# EAGLE design sensor (EAGLE 7.5.0)

## Sheet 1 of 3
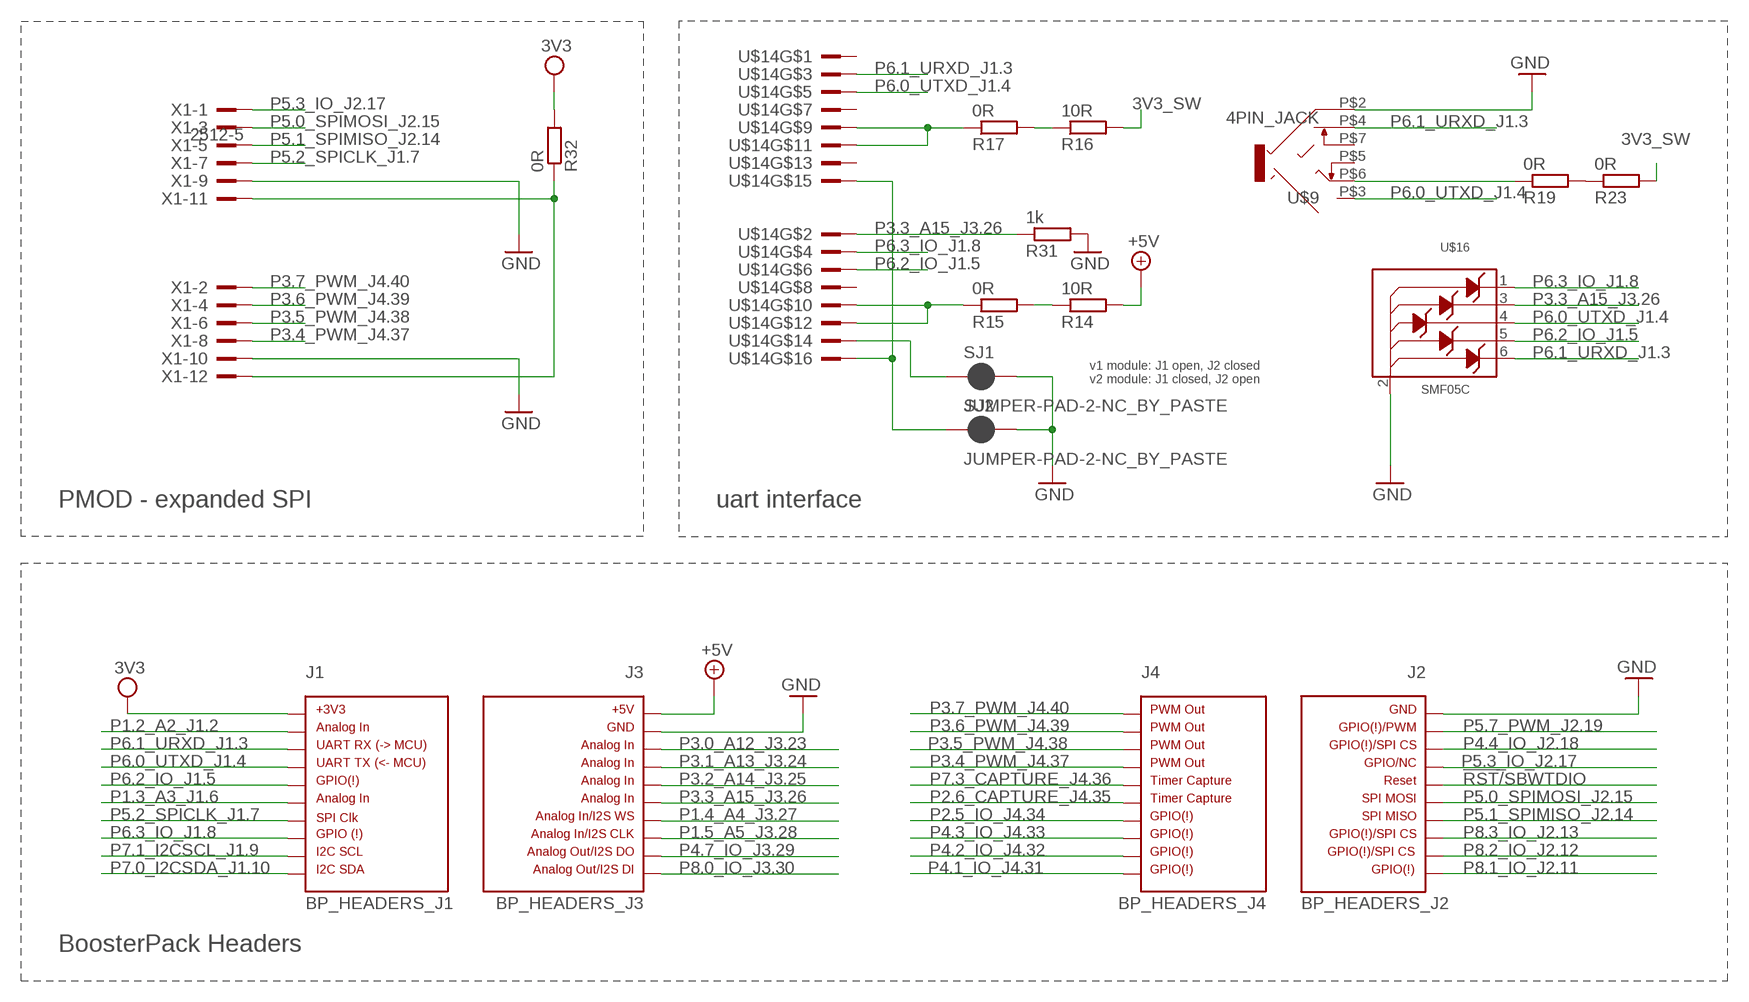
[diagram p0: schematic, sheet 1]

### Parts
J1  BP_HEADERS_J1  [J1]
J2  BP_HEADERS_J2  [J2]
J3  BP_HEADERS_J3  [J3]
J4  BP_HEADERS_J4  [J4]
R14  10R  R-EU_R0805W  [R0805W]
R15  0R  R-EU_0204/2V  [0204V]
R16  10R  R-EU_R0805W  [R0805W]
R17  0R  R-EU_0204/2V  [0204V]
R19  0R  R-EU_0204/2V  [0204V]
R23  0R  R-EU_R0805W  [R0805W]
R31  1k  R-EU_R0805W  [R0805W]
R32  0R  R-EU_0204/2V  [0204V]
SJ1  JUMPER-PAD-2-NC_BY_PASTE  [PAD-JUMPER-2-NC_BY_PASTE_YES_SILK]
SJ2  JUMPER-PAD-2-NC_BY_PASTE  [PAD-JUMPER-2-NC_BY_PASTE_YES_SILK]
U$9  4PIN_JACK  [4PIN_JACK]
U$14  2516-  [PAK100/2500-5-16]
U$16  SMF05C  [SC-88]
X1  2512-5  [PAK100/2500-5-12]

### Nets
3V3: J1.1 R32.2 ; also sheet 2,3
3V3_SW: R16.2 R23.2 ; also sheet 2
!RST!/SBWTDIO: J2.16
+5V: J3.21 R14.2 ; also sheet 2
GND: J2.20 J3.22 R31.2 SJ1.2 SJ2.2 U$9.P$2 U$16.2(ANODE) X1.9 X1.10 ; also sheet 2,3
N$4: R19.1 U$9.P$6
N$17: R16.1 R17.2
N$20: R17.1 U$14.9 U$14.11
N$21: R14.1 R15.2
N$22: R15.1 U$14.10 U$14.12
N$28: R19.2 R23.1
N$33: SJ1.1 U$14.14
N$34: SJ2.1 U$14.15 U$14.16
N$38: R32.1 X1.11 X1.12
P1.2_A2_J1.2: J1.2 ; also sheet 2
P1.3_A3_J1.6: J1.6 ; also sheet 3
P1.4_A4_J3.27: J3.27 ; also sheet 3
P1.5_A5_J3.28: J3.28 ; also sheet 3
P2.5_IO_J4.34: J4.34
P2.6_CAPTURE_J4.35: J4.35
P3.0_A12_J3.23: J3.23 ; also sheet 2
P3.1_A13_J3.24: J3.24 ; also sheet 2
P3.2_A14_J3.25: J3.25 ; also sheet 2
P3.3_A15_J3.26: J3.26 R31.1 U$14.2 U$16.3(CATODE2)
P3.4_PWM_J4.37: J4.37 X1.8
P3.5_PWM_J4.38: J4.38 X1.6
P3.6_PWM_J4.39: J4.39 X1.4
P3.7_PWM_J4.40: J4.40 X1.2
P4.1_IO_J4.31: J4.31
P4.2_IO_J4.32: J4.32
P4.3_IO_J4.33: J4.33
P4.4_IO_J2.18: J2.18
P4.7_IO_J3.29: J3.29 ; also sheet 2
P5.0_SPIMOSI_J2.15: J2.15 X1.3
P5.1_SPIMISO_J2.14: J2.14 X1.5
P5.2_SPICLK_J1.7: J1.7 X1.7
P5.3_IO_J2.17: J2.17 X1.1
P5.7_PWM_J2.19: J2.19
P6.0_UTXD_J1.4: J1.4 U$9.P$3 U$14.5 U$16.4(CATODE3)
P6.1_URXD_J1.3: J1.3 U$9.P$4 U$14.3 U$16.6(CATODE5)
P6.2_IO_J1.5: J1.5 U$14.6 U$16.5(CATODE4)
P6.3_IO_J1.8: J1.8 U$14.4 U$16.1(CATODE1)
P7.0_I2CSDA_J1.10: J1.10 ; also sheet 3
P7.1_I2CSCL_J1.9: J1.9 ; also sheet 3
P7.3_CAPTURE_J4.36: J4.36
P8.0_IO_J3.30: J3.30
P8.1_IO_J2.11: J2.11 ; also sheet 2
P8.2_IO_J2.12: J2.12
P8.3_IO_J2.13: J2.13
Unconnected: U$9.P$5 U$9.P$7 U$14.1 U$14.7 U$14.8 U$14.13

### Notes on the sheet
- v1 module: J1 open, J2 closed
  v2 module: J1 closed, J2 open
- PMOD - expanded SPI | uart interface
- BoosterPack Headers

## Sheet 2 of 3
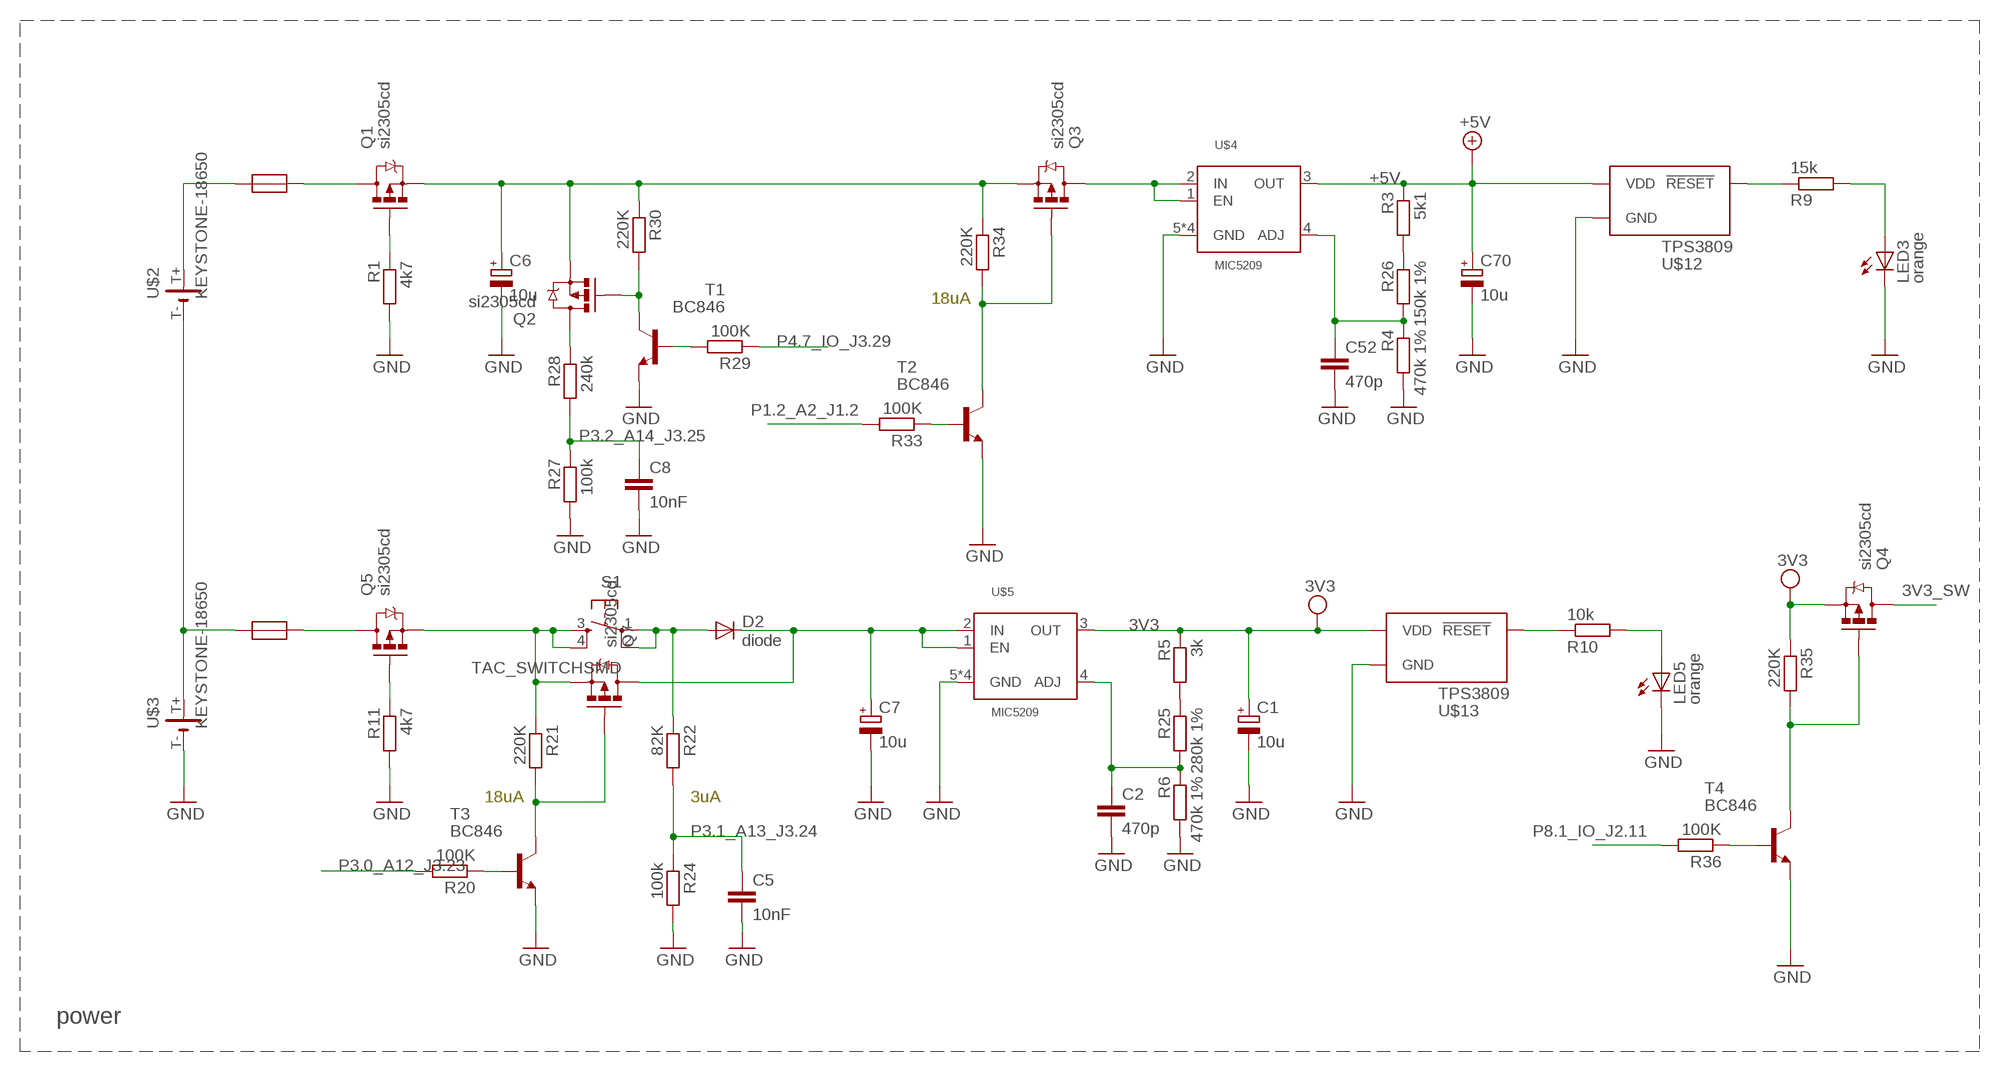
[diagram p1: schematic, sheet 2]

### Parts
C1  10u  CPOL-EU153CLV-0405  [153CLV-0405]
C2  470p  C-EUC0805  [C0805]
C5  10nF  C-EUC0805  [C0805]
C6  10u  CPOL-EU153CLV-0405  [153CLV-0405]
C7  10u  CPOL-EU153CLV-0405  [153CLV-0405]
C8  10nF  C-EUC0805  [C0805]
C52  470p  C-EUC0805  [C0805]
C70  10u  CPOL-EU153CLV-0405  [153CLV-0405]
D2  diode  DIODESMA  [SMA-DIODE]
LED3  orange  LEDCHIPLED_0805  [CHIPLED_0805]
LED5  orange  LEDCHIPLED_0805  [CHIPLED_0805]
Q1  si2305cd  MOSFET-PCHANNELSMD_POWER  [SOT23-3_POWER]
Q2  si2305cd  MOSFET-PCHANNELSMD_POWER  [SOT23-3_POWER]
Q3  si2305cd  MOSFET-PCHANNELSMD_POWER  [SOT23-3_POWER]
Q4  si2305cd  MOSFET-PCHANNELSMD_POWER  [SOT23-3_POWER]
Q5  si2305cd  MOSFET-PCHANNELSMD_POWER  [SOT23-3_POWER]
Q7  si2305cd  MOSFET-PCHANNELSMD_POWER  [SOT23-3_POWER]
R1  4k7  R-EU_R0805W  [R0805W]
R3  5k1  R-EU_R0805W  [R0805W]
R4  470k 1%  R-EU_R0805W  [R0805W]
R5  3k  R-EU_R0805W  [R0805W]
R6  470k 1%  R-EU_R0805W  [R0805W]
R9  15k  R-EU_R0805W  [R0805W]
R10  10k  R-EU_R0805W  [R0805W]
R11  4k7  R-EU_R0805W  [R0805W]
R20  100K  R-EU_R0805W  [R0805W]
R21  220K  R-EU_R0805W  [R0805W]
R22  82K  R-EU_R0805W  [R0805W]
R24  100k  R-EU_R0805W  [R0805W]
R25  280k 1%  R-EU_R0805W  [R0805W]
R26  150k 1%  R-EU_R0805W  [R0805W]
R27  100k  R-EU_R0805W  [R0805W]
R28  240k  R-EU_R0805W  [R0805W]
R29  100K  R-EU_R0805W  [R0805W]
R30  220K  R-EU_R0805W  [R0805W]
R33  100K  R-EU_R0805W  [R0805W]
R34  220K  R-EU_R0805W  [R0805W]
R35  220K  R-EU_R0805W  [R0805W]
R36  100K  R-EU_R0805W  [R0805W]
S1  TAC_SWITCHSMD  [TACTILE-SWITCH-SMD]
T1  BC846  [SOT23]
T2  BC846  [SOT23]
T3  BC846  [SOT23]
T4  BC846  [SOT23]
U$2  KEYSTONE-18650  [KEYSTONE_COMBO_18650]
U$3  KEYSTONE-18650  [KEYSTONE_COMBO_18650]
U$4  MIC5209  [SO-08]
U$5  MIC5209  [SO-08]
U$7  Fuse 1A  RESETTABLE_0805  [0805W]
U$8  Fuse 1A  RESETTABLE_0805  [0805W]
U$12  TPS3809  [R_PDSO_G3]
U$13  TPS3809  [R_PDSO_G3]

### Nets
3V3: C1.+ Q4.2(S) R5.1 R35.1 U$5.3(OUT) U$13.P$3(VDD) ; also sheet 1,3
3V3_SW: Q4.3(D) ; also sheet 1
+5V: C70.+ R3.1 U$4.3(OUT) U$12.P$3(VDD) ; also sheet 1
GND: C1.- C2.2 C5.2 C6.- C7.- C8.2 C52.2 C70.- LED3.C LED5.C R1.2 R4.2 R6.2 R11.2 R24.2 R27.2 T1.2(E) T2.2(E) T3.2(E) T4.2(E) U$3.T-(-) U$4.5(GND) U$4.6(GND) U$4.7(GND) U$4.8(GND) U$5.5(GND) U$5.6(GND) U$5.7(GND) U$5.8(GND) U$12.P$1(GND) U$13.P$1(GND) ; also sheet 1,3
N$1: C52.1 R4.1 R26.2 U$4.4(ADJ)
N$2: Q1.1(G) R1.1
N$3: C6.+ Q1.2(S) Q2.2(S) Q3.2(S) R30.1 R34.1
N$6: Q5.2(S) Q7.2(S) R21.1 S1.3 S1.4
N$7: LED3.A R9.2
N$9: C2.1 R6.1 R25.2 U$5.4(ADJ)
N$10: Q1.3(D) U$7.2
N$11: Q5.3(D) U$8.2
N$13: R9.1 U$12.P$2(!RESET)
N$14: LED5.A R10.2
N$15: R10.1 U$13.P$2(!RESET)
N$16: Q7.1(G) R21.2 T3.3(C)
N$23: C7.+ D2.C Q7.3(D) U$5.1(EN) U$5.2(IN)
N$24: Q5.1(G) R11.1
N$26: R5.2 R25.1
N$27: R3.2 R26.1
N$29: Q2.3(D) R28.1
N$30: Q2.1(G) R30.2 T1.3(C)
N$31: R20.1 T3.1(B)
N$32: R29.2 T1.1(B)
N$35: R33.1 T2.1(B)
N$36: Q3.3(D) U$4.1(EN) U$4.2(IN)
N$37: Q3.1(G) R34.2 T2.3(C)
N$39: R36.1 T4.1(B)
N$41: Q4.1(G) R35.2 T4.3(C)
N_BAT1: U$2.T-(-) U$3.T+(+) U$8.1
N_BAT2: U$2.T+(+) U$7.1
P1.2_A2_J1.2: R33.2 ; also sheet 1
P3.0_A12_J3.23: R20.2 ; also sheet 1
P3.1_A13_J3.24: C5.1 R22.2 R24.1 ; also sheet 1
P3.2_A14_J3.25: C8.1 R27.1 R28.2 ; also sheet 1
P4.7_IO_J3.29: R29.1 ; also sheet 1
P8.1_IO_J2.11: R36.2 ; also sheet 1
PUSH: D2.A R22.1 S1.1 S1.2

### Notes on the sheet
- 18uA
- 18uA | 3uA
- power

## Sheet 3 of 3
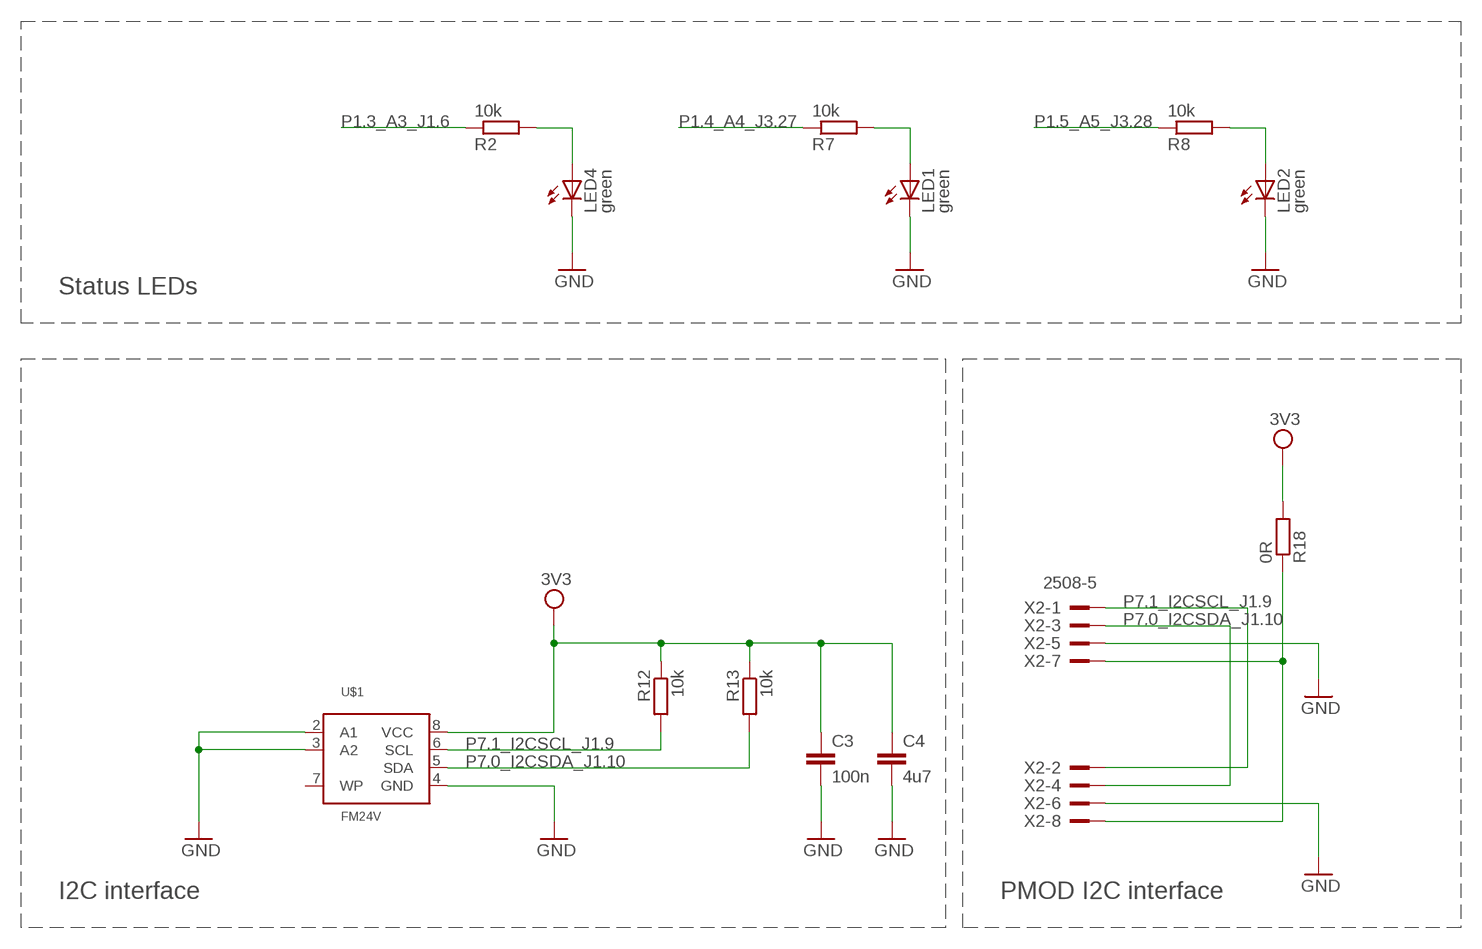
[diagram p2: schematic, sheet 3]

### Parts
C3  100n  C-EUC0805  [C0805]
C4  4u7  C-EUC0805  [C0805]
LED1  green  LEDCHIPLED_0805  [CHIPLED_0805]
LED2  green  LEDCHIPLED_0805  [CHIPLED_0805]
LED4  green  LEDCHIPLED_0805  [CHIPLED_0805]
R2  10k  R-EU_R0805W  [R0805W]
R7  10k  R-EU_R0805W  [R0805W]
R8  10k  R-EU_R0805W  [R0805W]
R12  10k  R-EU_R0805W  [R0805W]
R13  10k  R-EU_R0805W  [R0805W]
R18  0R  R-EU_0204/2V  [0204V]
U$1  FM24V  [SO-08]
X2  2508-5  [PAK100/2500-5-08]

### Nets
3V3: C3.1 C4.1 R12.1 R13.1 R18.2 U$1.8(VCC) ; also sheet 1,2
GND: C3.2 C4.2 LED1.C LED2.C LED4.C U$1.2(A1) U$1.3(A2) U$1.4(GND) X2.5 X2.6 ; also sheet 1,2
N$5: LED4.A R2.2
N$8: LED1.A R7.2
N$12: LED2.A R8.2
N$25: R18.1 X2.7 X2.8
P1.3_A3_J1.6: R2.1 ; also sheet 1
P1.4_A4_J3.27: R7.1 ; also sheet 1
P1.5_A5_J3.28: R8.1 ; also sheet 1
P7.0_I2CSDA_J1.10: R13.2 U$1.5(SDA) X2.3 X2.4 ; also sheet 1
P7.1_I2CSCL_J1.9: R12.2 U$1.6(SCL) X2.1 X2.2 ; also sheet 1
Unconnected: U$1.7(WP)

### Notes on the sheet
- Status LEDs
- I2C interface | PMOD I2C interface

## Library data of the parts
C1 C6 C7 C70 = rcl:CPOL-EU: POLARIZED CAPACITOR, European symbol
C2-C5 C8 C52 = rcl:C-EU: CAPACITOR, European symbol
D2 = SparkFun-DiscreteSemi:DIODE: Diode These are standard reverse protection diodes and small signal diodes. SMA package can handle up to about 1A. SOD-323 can handle about 200mA. What the SOD-323 package when ordering, there are some mfgs out there that are 5-pin packages.
J1 = LaunchPad_Template_Library:BP_HEADERS_J1
J2 = LaunchPad_Template_Library:BP_HEADERS_J2
J3 = LaunchPad_Template_Library:BP_HEADERS_J3
J4 = LaunchPad_Template_Library:BP_HEADERS_J4
LED1-LED5 = led:LED: LED OSRAM: - CHIPLED LG R971, LG N971, LY N971, LG Q971, LY Q971, LO R971, LY R971 LH N974, LH R974 LS Q976, LO Q976, LY Q976 LO Q996 - Hyper CHIPLED LW Q18S LB Q993, LB Q99A, LB R99A - SideLED LS A670, LO A670, LY A670, LG A670, LP A670 LB A673, LV A673, LT A673, LW A673 LH A674 LY A675 LS A676, LA A676, LO A676, LY A676, LW A676 LS A679, LY A679, LG A679 - Hyper Micro SIDELED® LS Y876, LA Y876, LO Y876, LY Y876 LT Y87S - SmartLED LW L88C, LW L88S LB L89C, LB L89S, LG L890 LS L89K, LO L89K, LY L89K LS L896, LA L896, LO L896, LY L896 - TOPLED LS T670, LO T670, LY T670, LG T670, LP T670 LSG T670, LSP T670, LSY T670, LOP T670, LYG T670 LG T671, LOG T671, LSG T671 LB T673, LV T673, LT T673, LW T673 LH T674 LS T676, LA T676, LO T676, LY T676, LB T676, LH T676, LSB T676, LW T676 LB T67C, LV T67C, LT T67C, LS T67K, LO T67K, LY T67K, LW E67C LS E67B, LA E67B, LO E67B, LY E67B, LB E67C, LV E67C, LT E67C LW T67C LS T679, LY T679, LG T679 LS T770, LO T770, LY T770, LG T770, LP T770 LB T773, LV T773, LT T773, LW T773 LH T774 LS E675, LA E675, LY E675, LS T675 LS T776, LA T776, LO T776, LY T776, LB T776 LHGB T686 LT T68C, LB T68C - Hyper Mini TOPLED® LB M676 - Mini TOPLED Santana® LG M470 LS M47K, LO M47K, LY M47K Source: http://www.osram.convergy.de LUXEON: - LUMILED® LXK2-PW12-R00, LXK2-PW12-S00, LXK2-PW14-U00, LXK2-PW14-V00 LXK2-PM12-R00, LXK2-PM12-S00, LXK2-PM14-U00 LXK2-PE12-Q00, LXK2-PE12-R00, LXK2-PE12-S00, LXK2-PE14-T00, LXK2-PE14-U00 LXK2-PB12-K00, LXK2-PB12-L00, LXK2-PB12-M00, LXK2-PB14-N00, LXK2-PB14-P00, LXK2-PB14-Q00 LXK2-PR12-L00, LXK2-PR12-M00, LXK2-PR14-Q00, LXK2-PR14-R00 LXK2-PD12-Q00, LXK2-PD12-R00, LXK2-PD12-S00 LXK2-PH12-R00, LXK2-PH12-S00 LXK2-PL12-P00, LXK2-PL12-Q00, LXK2-PL12-R00 Source: www.luxeon.com KINGBRIGHT: KA-3528ASYC Source: www.kingbright.com
Q1-Q5 Q7 = Simplex-DiscreteSemi:MOSFET-PCHANNEL: Generic PMOSFET
R1-R36 = rcl:R-EU_: RESISTOR, European symbol
S1 = SparkFun-Electromechanical:TAC_SWITCH: Momentary Switch Button commonly used for reset or general input. Spark Fun Electronics SKU : COM-00097 SMT- SWCH-08247; PROD_ID: SWCH-08247
SJ1 SJ2 = SparkFun-Passives:JUMPER-PAD-2-NC_BY_PASTE
T1-T4 = transistor:BC846: NPN TRANSISTOR
U$1 = Simplex-ICs:FM24V: CYPRESS FM24Vxx serial f-ram
U$2 U$3 = Simplex-Battery:KEYSTONE-18650
U$4 U$5 = Simplex-ICs:MIC5209: Micrel MIC5209
U$7 U$8 = Simplex-Fuses:RESETTABLE: resettable fuse
U$9 = Simplex-Connectors:4PIN_JACK
U$12 U$13 = Simplex-ICs:TPS3809: Texas Instruments TPS3809
U$14 = Simplex-Connectors:2516-
U$16 = Simplex-DiscreteSemi:SMF05C: ON Semiconductor SMF05C 5-line transient voltage suppressor array
X1 = Simplex-Connectors:2512-: 3M (TM) Pak 100 4-Wall Header Source: 3M; MPN: N2514-5002RB; OC_FARNELL: 1788673; OC_NEWARK: 97K6709
X2 = Simplex-Connectors:2508-: 3M (TM) Pak 100 4-Wall Header Source: 3M; OC_FARNELL: 1788669; OC_NEWARK: unknown

## Net classes
1 vcc: width 0.203 mm

## Board
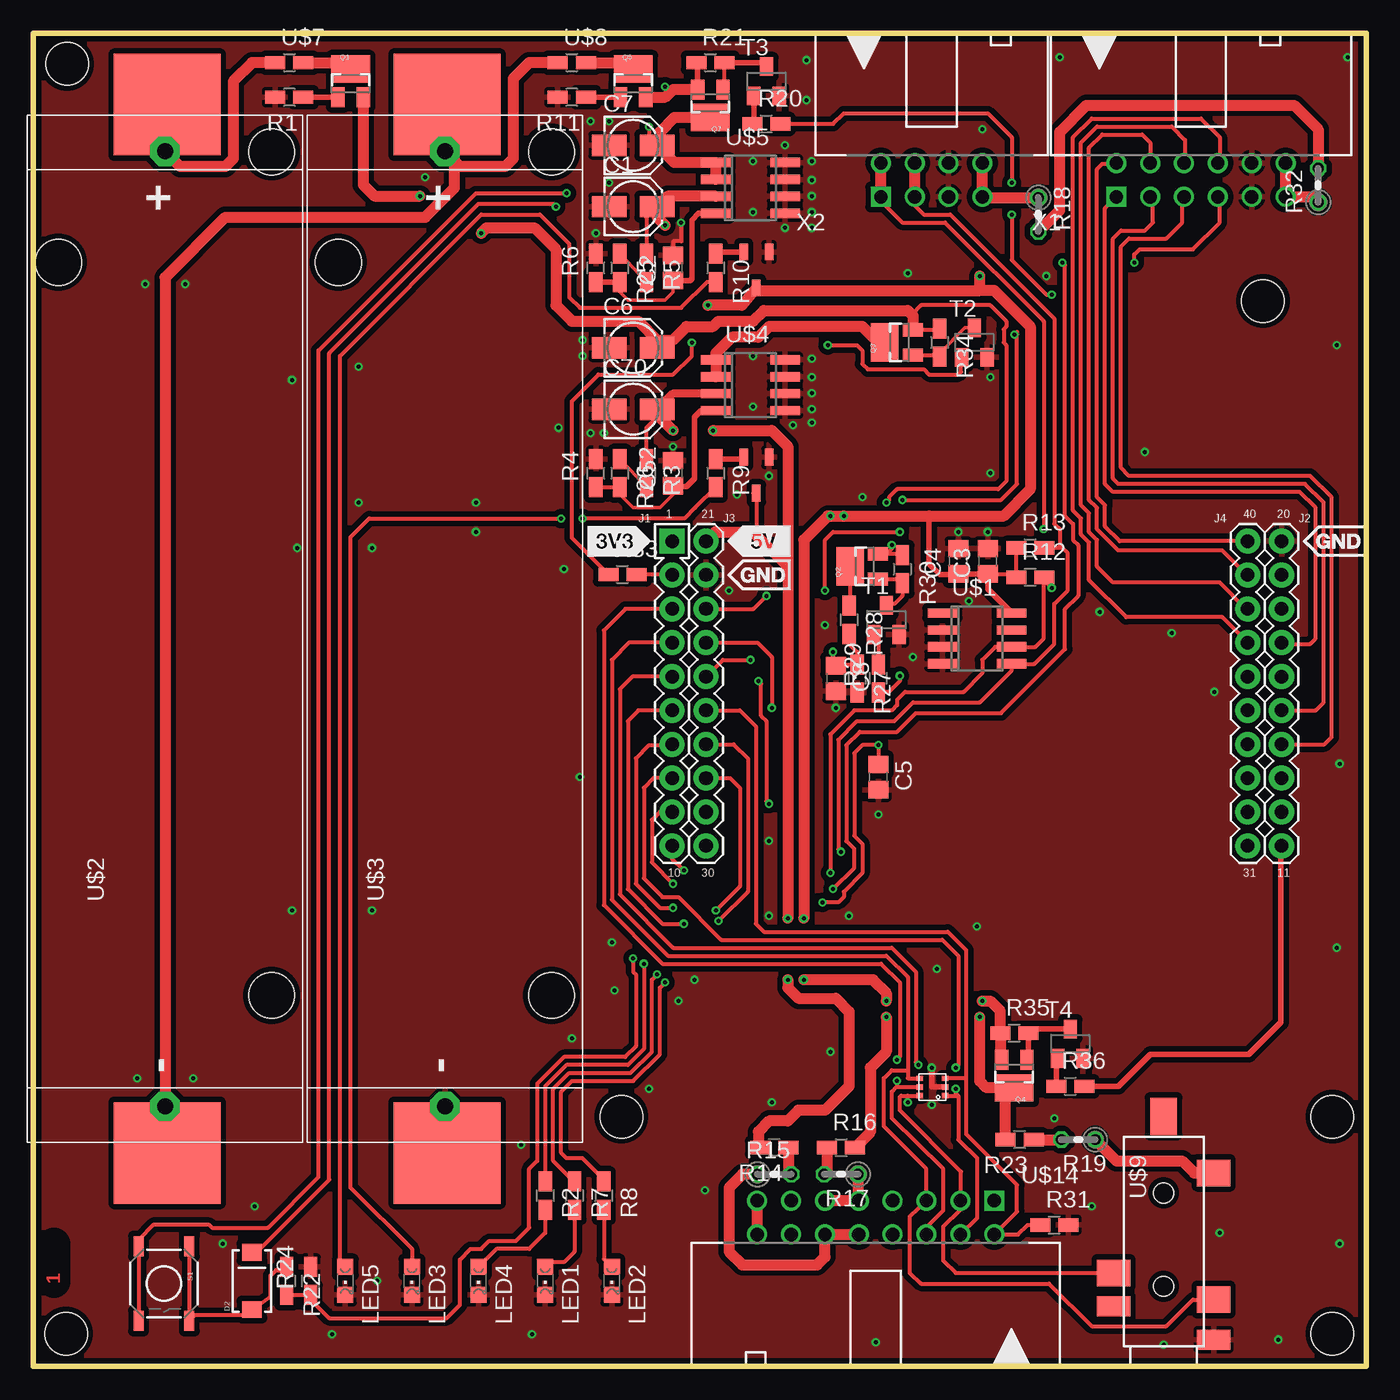
[diagram p3: board, top side]
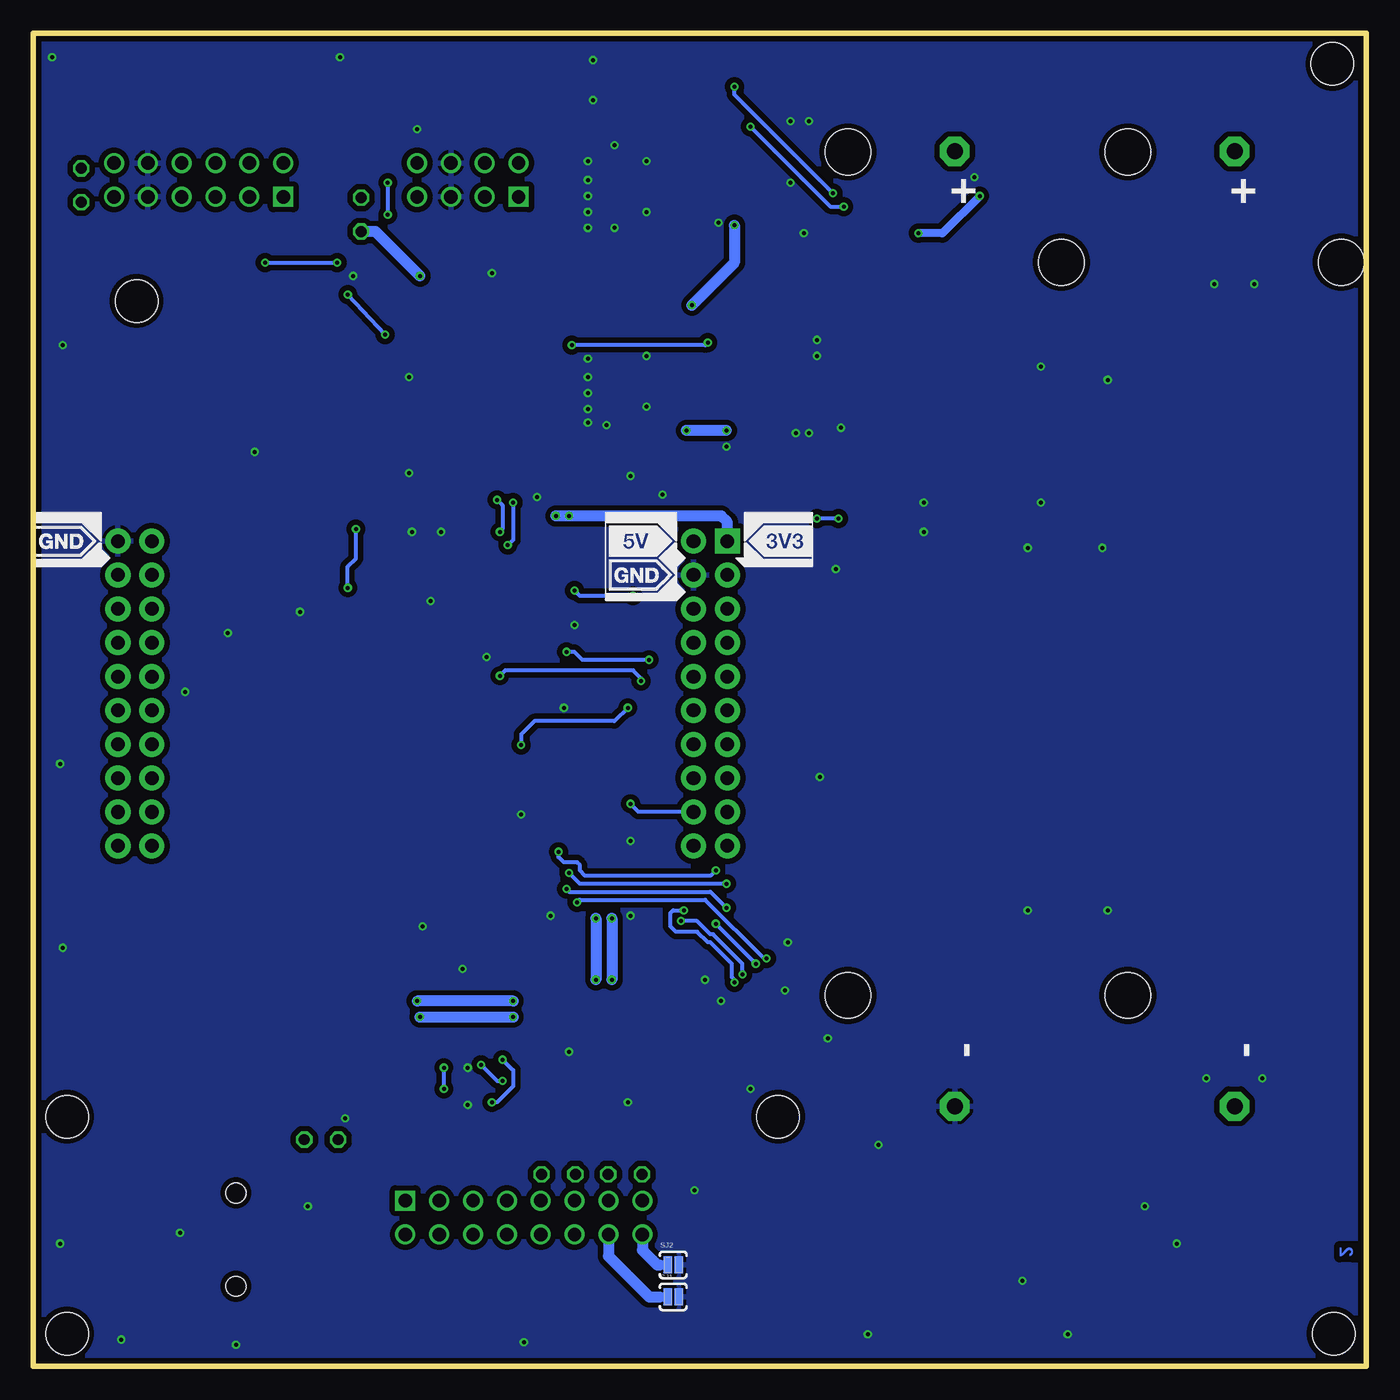
[diagram p4: board, bottom side, seen from below]

Size 100 x 100 mm. Coordinates in mm from the lower left corner, seen from the top.
Outline: 0,0 100,0 100,100 0,100 0,0
Copper layers (1*16): Top 0.035mm / dielectric 1.5mm / Bottom 0.035mm
Design rules "seeed_2-layer_20140221 *": minimum track width 6mil, minimum drill 0.3mm, track to track 10mil, track to pad 10mil, pad to pad 10mil, via to via 10mil, smd to smd 0mil, copper to edge 10mil, drill to drill 10mil, minimum pad ring 6mil, minimum via ring 6mil, stop-mask expansion 2mil, vias tented up to drill 100mil, thermal gap 10mil
Holes 3.2 mm at 2.45,2.45 44.12,18.72 97.46,18.72 2.54,97.71 97.46,2.45 92.26,79.92
tRestrict: 1 lines

### Footprints (pad centres in the part's own frame; a part is rotated, then mirrored left to right if it is on the bottom)
153CLV-0405 = smd 2.6 x 1.6: + 1.8,0; - -1.8,0
C0805 = smd 1.3 x 1.5: 1 -0.95,0; 2 0.95,0
SMA-DIODE = smd 1.27 x 1.47: A -2.15,0; C 2.15,0
J1 = drill 1.016 pad 1.88 square: 1 0,22.86 | drill 1.016 pad 1.88: 2 0,20.32; 3 0,17.78; 4 0,15.24; 5 0,12.7; 6 0,10.16; 7 0,7.62; 8 0,5.08; 9 0,2.54; 10 0,0
J2 = drill 1.016 pad 1.88: 11 0,0; 12 0,2.54; 13 0,5.08; 14 0,7.62; 15 0,10.16; 16 0,12.7; 17 0,15.24; 18 0,17.78; 19 0,20.32; 20 0,22.86
J3 = drill 1.016 pad 1.88: 21 0,22.86; 22 0,20.32; 23 0,17.78; 24 0,15.24; 25 0,12.7; 26 0,10.16; 27 0,7.62; 28 0,5.08; 29 0,2.54; 30 0,0
J4 = drill 1.016 pad 1.88: 31 0,0; 32 0,2.54; 33 0,5.08; 34 0,7.62; 35 0,10.16; 36 0,12.7; 37 0,15.24; 38 0,17.78; 39 0,20.32; 40 0,22.86
CHIPLED_0805 = smd 1.2 x 1.2: A 0,-1.05; C 0,1.05
SOT23-3_POWER = smd 1 x 1.5: 1 -0.939,-1.384; 2 0.961,-1.384 | smd 2.9 x 2.05: 3 0.011,0.716
R0805W = smd 1.5 x 1: 1 -1.052,0; 2 1.052,0
0204V = drill 0.813 octagon: 1 -1.27,0; 2 1.27,0
TACTILE-SWITCH-SMD = smd 1.524 x 0.762: 1 -2.794,1.905; 2 2.794,1.905; 3 -2.794,-1.905; 4 2.794,-1.905
PAD-JUMPER-2-NC_BY_PASTE_YES_SILK = smd 0.635 x 1.27: 1 -0.401,0; 2 0.413,0
SOT23 = smd 1 x 1.4: 1 -0.95,-1.1; 2 0.95,-1.1; 3 0,1.1
SO-08 = smd 0.7 x 2.2: 1 -1.905,-2.6; 2 -0.635,-2.6; 3 0.635,-2.6; 4 1.905,-2.6; 5 1.905,2.6; 6 0.635,2.6; 7 -0.635,2.6; 8 -1.905,2.6
KEYSTONE_COMBO_18650 = drill 1.2 pad 2.184 octagon: T+ 74.34,10.325; T- 2.7,10.325 | smd 7.6 x 8: T+$1 77.855,10.16; T-$1 -0.805,10.16 | hole 3.45: 11.025,2.32; 66.025,18.325; 74.305,2.32
0805W = smd 1.5 x 1: 1 -1.052,0; 2 1.052,0
4PIN_JACK = smd 1.5 x 2.5: P$2 2,-3.75; P$7 4.5,3.75 | smd 2 x 2.5: P$3 5,-3.75; P$4 7,3.75; P$6 14.5,-3.75 | smd 2.8 x 2: P$5 18.75,0 | hole 1.5: 6,0; 13,0
R_PDSO_G3 = smd 0.635 x 1.27: P$1 0,0; P$2 1.9,0; P$3 0.95,2.7
PAK100/2500-5-16 = drill 1 pad 1.422 square: 1 -8.89,-7.62 | drill 1 pad 1.422: 2 -8.89,-5.08; 3 -6.35,-7.62; 4 -6.35,-5.08; 5 -3.81,-7.62; 6 -3.81,-5.08; 7 -1.27,-7.62; 8 -1.27,-5.08; 9 1.27,-7.62; 10 1.27,-5.08; 11 3.81,-7.62; 12 3.81,-5.08; 13 6.35,-7.62; 14 6.35,-5.08; 15 8.89,-7.62; 16 8.89,-5.08
SC-88 = smd 0.5 x 0.4: 1 0,1.3; 2 0,0.65; 3 0,0; 4 1.9,0; 5 1.9,0.65; 6 1.9,1.3
PAK100/2500-5-12 = drill 1 pad 1.422 square: 1 -6.35,-1.27 | drill 1 pad 1.422: 2 -6.35,1.27; 3 -3.81,-1.27; 4 -3.81,1.27; 5 -1.27,-1.27; 6 -1.27,1.27; 7 1.27,-1.27; 8 1.27,1.27; 9 3.81,-1.27; 10 3.81,1.27; 11 6.35,-1.27; 12 6.35,1.27
PAK100/2500-5-08 = drill 1 pad 1.422 square: 1 -3.81,-1.27 | drill 1 pad 1.422: 2 -3.81,1.27; 3 -1.27,-1.27; 4 -1.27,1.27; 5 1.27,-1.27; 6 1.27,1.27; 7 3.81,-1.27; 8 3.81,1.27

### Placement (x,y rotation side)
C1  45,87 0 top
C2  48,82.4 90 top
C3  71.6,60.4 90 top
C4  69.4,60.4 90 top
C5  63.4,44.2 270 top
C6  45,76.4 0 top
C7  45,91.6 0 top
C8  60.2,51.6 270 top
C52  48,67 90 top
C70  45,71.8 0 top
D2  16.4,6.4 90 top
J1  47.93,39.04 0 top
J2  93.65,39.04 0 top
J3  50.47,39.04 0 top
J4  91.11,39.04 0 top
LED1  38.4,6.4 180 top
LED2  43.4,6.4 180 top
LED3  28.4,6.4 180 top
LED4  33.4,6.4 180 top
LED5  23.4,6.4 180 top
Q1  23.8,96.6 0 top
Q2  62,60 90 top
Q3  64.6,76.8 90 top
Q4  73.6,21.6 180 top
Q5  45,96.6 0 top
Q7  50.8,94.4 180 top
R1  19.2,95.2 180 top
R2  38.4,12.8 270 top
R3  46,67 270 top
R4  42.2,67 90 top
R5  46,82.4 270 top
R6  42.2,82.4 90 top
R7  40.6,12.8 270 top
R8  42.8,12.8 270 top
R9  51.2,67 270 top
R10  51.2,82.4 270 top
R11  40.4,95.2 180 top
R12  74.8,59.2 0 top
R13  74.8,61.4 0 top
R14  55.6,16.4 180 top
R15  55.6,14.4 0 top
R16  60.6,16.4 0 top
R17  60.6,14.4 180 top
R18  75.4,86.4 270 top
R19  78.4,17 180 top
R20  55,93.2 0 top
R21  50.8,97.8 0 top
R22  19,6.4 270 top
R23  74,17 180 top
R24  20.8,6.4 90 top
R25  44,82.4 270 top
R26  44,67 270 top
R27  61.8,51.6 270 top
R28  61.2,56 270 top
R29  63.4,51.6 90 top
R30  65.2,59.8 270 top
R31  76.6,10.6 0 top
R32  96.4,88.6 90 top
R33  44.2,59.4 0 top
R34  68,76.8 270 top
R35  73.6,25 0 top
R36  77.8,21 0 top
S1  9.8,6.2 270 top
SJ1  52,5.2 0 bottom
SJ2  52,7.6 0 bottom
T1  64,56 0 top
T2  70.6,76.8 0 top
T3  55,96.4 0 top
T4  77.8,24.2 0 top
U$1  70.8,54.6 270 top
U$2  20.2,16.8 90 top
U$3  41.2,16.8 90 top
U$4  53.8,73.6 270 top
U$5  53.8,88.4 270 top
U$7  19.2,97.8 0 top
U$8  40.4,97.8 0 top
U$9  84.8,0 90 top
U$12  55.2,68.2 180 top
U$13  55.2,83.6 180 top
U$14  63.2,4.8 180 top
U$16  68.4,21.6 180 top
X1  87.6,89 0 top
X2  67.4,89 0 top

### Tracks (layer width: path | path; a pad name or v marks a point on that pad's centre or on a via)
3V3  (via drill 0.3)
  Top 0.305: C3.1 73.5,59.45 R12.1 R13.1 | C1.+ 46,86.2 R5.1
  Top 0.406: 67.2,63.8 67.2,60.2 68,59.4 69.35,59.4 C4.1 C3.1 71.6,58.3 U$1.8
  Top 0.813: U$5.3 47.56,87.77 C1.+ 46.8,86.2 v47.4,85.6 | v50.6,79.6 53.15,79.6 U$13.P$3 54.45,80.7 71,80.7 | v57.8,33.6 57.8,62 59.6,63.8 v59.8,63.8 v60.8,63.8 67.2,63.8 72.8,63.8 74.8,65.8 74.8,78 72.1,80.7 71,80.7 | v57.8,29 63,29 64,28 v64,27.4 | 71,80.7 v71,81.8 | R18.2 77,86.73 77,92.6 79,94.6 94.6,94.6 96.4,92.8 R32.2 | Q4.2 72.55,23.07 R35.1 72.55,26.65 71.8,27.4 v71.2,27.4
  Bottom 0.813: J1.1 47.93,63.33 48.4,63.8 v60.8,63.8 | v47.4,85.6 47.4,82.8 v50.6,79.6 | v57.8,33.6 v57.8,29 | v71,81.8 74.33,85.13 R18.2 | v64,27.4 v71.2,27.4
3V3_SW  (via drill 0.3)
  Top 0.813: Q4.3 72.8,20.88 | 72.8,20.88 71.52,20.88 71,21.4 v71,26.2 | v64,26.2 64,23.6 62.8,22.4 62.8,17.55 R16.2 | R23.2 72.95,20.74 72.8,20.88
  Bottom 0.813: v71,26.2 v64,26.2
+5V  (via drill 0.3)
  Top 0.305: U$12.P$3 54.25,62.85 54,62.6 | R3.1 46,70.4 46.9,71.3
  Top 0.406: U$12.P$3 54.07,65.5
  Top 0.61: 46.8,71.4 C70.+ 47.97,72.97 U$4.3
  Top 0.813: J3.21 51.17,62.6 54,62.6 56.6,60 | 56.6,60 v56.6,33.6 | 46.8,71.4 46.9,71.3 v48,70.2 | v51,70.2 55.4,70.2 56.6,69 56.6,60 | v56.6,29 56.6,28.4 57.4,27.6 60.2,27.6 61.2,26.6 61.2,21 59.4,19.2 57.4,19.2 56.6,18.4 55.2,18.4 54.4,17.6 54.4,16.55 R14.2
  Bottom 0.813: v48,70.2 v51,70.2 | v56.6,33.6 v56.6,29
GND  (via drill 0.3)
  Top 0.305: v48.6,85.8 48.6,84.4 48,84.4 C2.2
  Top 0.406: U$16.2 67.4,20.95 v67.4,22.4
  other vias: 43.2,88.8 43.2,93.4 41.2,77 42.8,70 48,69 12,21.6 11.4,81.2 8.4,81.2 7.8,21.6 29.4,89.2 19.4,74 43.6,28.2 22.4,2.4 37.4,2.4 19.4,34.2 16.6,12 55.2,66.8 58.4,71.8 66,53.2 70.2,57.4 71.6,62.6 54,86.6 54,90.4 56.4,91.6 56.4,85.4 54,75.8 54,72 58.4,89 58.4,87.8 58.4,74.2 58.4,73 59.4,55.6 63.4,41.4 71.8,74.2 80,56.6 71.8,67 85.4,55 76,81.8 55.2,33.8 76.6,18.6 61.2,33.8 46.2,20.8 43.4,31.8 41,44.2 36.6,16.6 25.8,6.4 25.4,34.2 25.4,61.4 19.8,61.4 70.8,33 49.6,29 55.2,39.4 41.8,93.4 41.2,75.8 42.2,85 58.4,75.6 50.4,13.2 48.4,27.4 40.4,24.6 24.4,64.8 33.2,64.8 33.2,62.6 39.8,59.8 65.6,82 58.4,86.6 71.2,92.8 58,95 14.2,9.2 69.4,62.6 62.2,65.2 52.8,65.4 57,70.6 84.8,1.6 93.4,2 79.4,12 89,10 63.2,1.8 97.8,31.4 98,9.2 98.6,98.2 77,98.2 58,98 39.4,70.4 41.8,70 52.2,58.2 97.8,76.6 58.4,70.8 98,45.2 88.6,50.6 24.4,75 60.2,49.4 67.4,19.6 83.4,68.6 58.4,90.4 58.4,85.4 59.8,23.6 55.4,19.8 67.8,29.8
  pour Top (isolate 0.406): 0,100 100,100 100,0 0,0
  pour Bottom (isolate 0.406): 0,100 100,100 100,0 0,0
N$1
  Top 0.254: R26.2 44,65.4 45,64.4 47,64.4 48,65.4 C52.1
  Top 0.305: R4.1 R26.2 | U$4.4 50.09,71.69
  Top 0.406: C52.1 48.05,66 49,66 49.6,66.6 49.6,71.2 50.09,71.69
N$2
  Top 0.406: R1.1 22.86,95.2 Q1.1
N$3  (via drill 0.3)
  Top 0.305: v64,64.8 64.2,65 64.2,65.2 64.8,65.8 72.4,65.8 73,66.4 73,76.6 72.8,76.8 72.8,77.8 73,78 73,78.4 71.8,79.6 66.6,79.6 65.9,78.9 | Q2.2 64,60.96 | 64,60.96 65.09,60.96 R30.1 | v64.4,61.6 64.4,61.36 64,60.96 | Q3.2 67.69,77.76 R34.1
  Top 0.61: 65.9,78.9 66,78.8 | 66,77.78 Q3.2
  Top 0.813: C6.+ 46.8,77 | Q1.2 24.76,88.64 25.6,87.8 v29,87.8 | 46.8,77 45.4,78.4 40.4,78.4 39.2,79.6 39.2,83.8 37.6,85.4 34,85.4 v33.6,85 | 65.9,78.9 65.6,79.2 54.8,79.2 54,78.4 51.4,78.4 51,78 49,78 48,77 46.8,77 | 66,78.8 66,77.78
  Bottom 0.305: v64,64.8 64,62 v64.4,61.6
  Bottom 0.61: v29,87.8 31.8,85 v33.6,85
N$4
  Top 0.813: R19.1 81.27,15.4 86.2,15.4 87.1,14.5 U$9.P$6
N$5
  Top 0.305: R2.2 38.4,10 37.2,8.8 34.75,8.8 LED4.A
N$6  (via drill 0.3)
  Top 0.305: v40,88 33.2,88 21.4,76.2 21.4,14.2 17.6,10.4 13.4,10.4 13.2,10.6 9,10.6 7.89,9.49 S1.3 S1.4 | v47.4,96 47.8,95.6
  Top 0.406: Q7.2 49.84,97.71 R21.1
  Top 0.813: Q5.2 47.42,95.22 47.8,95.6 48,95.8 49.82,95.8 Q7.2
  Bottom 0.305: v40,88 47.4,95.4 v47.4,96
N$7  (via drill 0.3)
  Top 0.305: LED3.A 28.4,8.8 23.8,13.4 23.8,62.2 25.2,63.6 v39.6,63.6 | R9.2 49.65,64.4 48.85,63.6 v41.2,63.6
  Bottom 0.305: v39.6,63.6 v41.2,63.6
N$8
  Top 0.305: R7.2 40.6,8.6 39.8,7.8 38.75,7.8 LED1.A
N$9
  Top 0.254: R25.2 44,80.6 44.6,80 47.4,80 48,80.6 C2.1
  Top 0.406: 47.9,81.35 C2.1 49.25,81.45 49.4,81.6 49.4,86 49.9,86.5 U$5.4 | R6.1 R25.2
N$10
  Top 0.813: U$7.2 23.81,97.8 Q1.3
N$11
  Top 0.813: U$8.2 45.01,97.8 Q5.3
N$12
  Top 0.305: R8.2 42.8,8.05 LED2.A
N$13
  Top 0.406: R9.1 53.15,68.05 U$12.P$2
N$14
  Top 0.305: R10.2 50.55,81.35 48.6,79.4 41,79.4 40.2,80.2 40.2,84.2 38,86.4 33.6,86.4 23,75.8 23,7.85 LED5.A
N$15
  Top 0.406: R10.1 51.35,83.6 U$13.P$2
N$16
  Top 0.305: Q7.1 51.85,95.9 R21.2
  Top 0.406: 51.74,97.69 R21.2 54.7,97.8 T3.3
N$17
  Top 0.813: R16.1 59.55,14.62 R17.2
N$20
  Top 0.813: U$14.11 U$14.9 61.87,12.48 R17.1
N$21
  Top 0.813: R14.1 56.65,14.62 R15.2
N$22
  Top 0.813: U$14.10 U$14.12 59.4,8.2 58.8,7.6 53.2,7.6 52.2,8.6 52.2,13.4 53.2,14.4 R15.1
N$23  (via drill 0.3)
  Top 0.305: v39.2,87 39,87.2 33.4,87.2 22.2,76 22.2,14 16.4,8.2 D2.C | v46.2,93 46.2,91.6 C7.+
  Top 0.813: Q7.3 48.08,93.68 47,92.6 47,91.8 C7.+ 48.09,90.31 U$5.1 U$5.2
  Bottom 0.305: v46.2,93 40.2,87 v39.2,87
N$24
  Top 0.406: R11.1 44.06,95.2 Q5.1
N$25
  Top 0.813: X2.8 X2.7 71.27,87.67 R18.1
N$26
  Top 0.254: R5.2 R25.1
N$27
  Top 0.254: R26.1 R3.2
N$28
  Top 0.813: R23.1 R19.2
N$29
  Top 0.305: Q2.3 61.28,57.14 R28.1
N$30
  Top 0.305: Q2.1 64.89,59.06 R30.2 65.2,57.8 64.6,57.2 64.1,57.2 T1.3
N$31
  Top 0.406: T3.1 54.05,93.3 R20.1
N$32
  Top 0.305: T1.1 63.4,54.55 R29.2
N$33
  Bottom 0.61: 53,5.2 SJ1.1
  Bottom 0.813: U$14.14 56.85,8.25 53.8,5.2 53,5.2
N$34
  Top 0.813: U$14.15 U$14.16
  Bottom 0.61: 53,7.6 SJ2.1
  Bottom 0.813: U$14.16 54.31,8.71 53.2,7.6 53,7.6
N$35  (via drill 0.3)
  Top 0.305: R33.1 40.4,62.15 40.4,72.4 42.4,74.4 48,74.4 49.4,75.8 v49.4,76.8 | v59.6,76.6 61.8,76.6 62.2,76.2 62.2,75.2 62.6,74.8 66.8,74.8 67.2,74.4 69.4,74.4 69.6,74.6 69.6,75.65 T2.1
  Bottom 0.305: v49.4,76.8 49.6,76.6 v59.6,76.6
N$36
  Top 0.813: Q3.3 63.39,76.81 62.2,78 55.2,78 54.4,77.2 52.4,77.2 51.2,76 U$4.1 U$4.2
N$37
  Top 0.254: R34.2 68,76 69.9,77.9 T2.3
  Top 0.305: Q3.1 67.49,75.86 R34.2
N$38
  Top 0.813: X1.12 X1.11 96,87.73 R32.1
N$39
  Top 0.406: T4.1 76.75,23 R36.1
N$41
  Top 0.406: Q4.1 74.65,23.1 R35.2 74.95,25.3 T4.3
N_BAT1
  Top 0.813: U$2.T- 9.88,81.67 14.4,86.2 29.4,86.2 31.6,88.4 31.6,91.06 U$3.T+ 32.02,90 35.4,90 36,90.6 36,96.6 37.2,97.8 U$8.1
N_BAT2
  Top 0.813: U$7.1 16.4,97.8 15,96.4 15,90.6 14.4,90 11.02,90 U$2.T+
P1.2_A2_J1.2
  Top 0.305: J1.2 47.24,59.36 47.2,59.4 R33.2
P1.3_A3_J1.6  (via drill 0.3)
  Top 0.305: J1.6 45.4,49.2 44.6,48.4 44.6,35.8 47.2,33.2 v48.8,33.2 | v45.8,30.2 45.8,23.8 44.6,22.6 40,22.6 38.4,21 R2.1
  Bottom 0.305: v48.8,33.2 v45.8,30.2
P1.4_A4_J3.27  (via drill 0.3)
  Top 0.305: J3.27 52.54,46.66 53.6,45.6 53.6,35.6 v51.4,33.4 | R7.1 40.55,13.85 39,15.4 39,20.8 40.2,22 44.8,22 46.4,23.6 46.4,29 v46.8,29.4
  Bottom 0.305: v46.8,29.4 46.8,30.2 49,32.4 49.2,32.4 50.2,33.4 v51.4,33.4
P1.5_A5_J3.28  (via drill 0.3)
  Top 0.305: J3.28 52.28,44.12 53,43.4 53,36 v51.2,34.2 | R8.1 42.8,14 41.2,15.6 40,15.6 39.6,16 39.6,20.6 40.4,21.4 45,21.4 47,23.4 47,28.4 v47.4,28.8
  Bottom 0.305: v47.4,28.8 47.4,29 47.6,29.2 47.6,30.2 49.2,31.8 49.4,31.8 50.2,32.6 51.8,32.6 52.2,33 52.2,34 52,34.2 v51.2,34.2
P3.0_A12_J3.23  (via drill 0.3)
  Top 0.305: J3.23 54.02,56.82 v55,57.8 | v59.4,58.2 59.4,62 60,62.6 v65,62.6 | v65.2,65 72.6,65 73.8,66.2 73.8,77.4 | 73.8,77.4 73.8,77.6 | v73.6,77.4 73.8,77.4 | R20.2 60,93.2 60.8,94 71.6,94 73.4,92.2 v73.4,88.8 | v76.4,80.4 76,80.4 73.4,83 v73.4,86.4
  Bottom 0.305: v55,57.8 59,57.8 v59.4,58.2 | v76.4,80.4 v73.6,77.4 | v65.2,65 64.8,64.6 64.8,62.8 v65,62.6 | v73.4,88.8 v73.4,86.4
P3.1_A13_J3.24  (via drill 0.3)
  Top 0.305: R22.2 R24.1 20.8,5 22.2,3.6 31,3.6 32,4.6 32,8 32.8,8.8 33.6,8.8 34.2,9.4 36.2,9.4 37.2,10.4 37.2,14.8 37.8,15.4 37.8,21.2 39.8,23.2 44.4,23.2 45.2,24 45.2,29.4 45,29.6 v45,30.6 | J3.24 54.32,54.28 55.4,53.2 v55.4,49.4 | 63.45,45.2 C5.1 v63.4,46.6 62.2,46.6 61.6,46 61.6,39.8 62.2,39.2 62.2,37 60.8,35.6 60.8,35.2 60.4,34.8 v59.2,34.8
  Bottom 0.305: v55.4,49.4 56.4,48.4 62.4,48.4 63.4,47.4 v63.4,46.6 | v59.2,34.8 59,35 49.6,35 45.2,30.6 v45,30.6
P3.2_A14_J3.25  (via drill 0.3)
  Top 0.305: R28.2 61.2,54.2 61.8,53.6 R27.1 60,52.65 v60,53.6 60,52.75 C8.1 | J3.25 51.73,53 v53.8,53
  Bottom 0.305: v53.8,53 58.8,53 59.4,53.6 v60,53.6
P3.3_A15_J3.26
  Top 0.305: R31.1 74.6,10.6 73.88,9.88 U$14.2 73.8,11.59 73.8,13.6 70,17.4 70,21.6 | J3.26 53,49.2 54.2,48 54.2,33.2 54.8,32.6 68.6,32.6 70,31.2 70,21.6 | 70,21.6 U$16.3
P3.4_PWM_J4.37
  Top 0.305: J4.37 89.2,56.2 82,56.2 79.2,59 79.2,61.8 78.6,62.4 78.6,63.6 78,64.2 78,92.2 79.4,93.6 87.6,93.6 89,92.2 89,90.4 X1.8
P3.5_PWM_J4.38
  Top 0.305: J4.38 90.98,56.82 89,58.8 81,58.8 79.8,60 79.8,62 79.2,62.6 79.2,64 78.6,64.6 78.6,91.8 79.8,93 85.4,93 86.4,92 86.4,90.34 X1.6
P3.6_PWM_J4.39
  Top 0.305: J4.39 91.04,59.36 89.2,61.2 81.4,61.2 79.8,62.8 79.8,64.4 79.2,65 79.2,91.4 80.2,92.4 83.2,92.4 83.8,91.8 X1.4
P3.7_PWM_J4.40
  Top 0.305: J4.40 81.5,61.9 80.4,63 80.4,64.6 79.8,65.2 79.8,89.8 80.2,90.2 81.18,90.2 X1.2
P4.7_IO_J3.29  (via drill 0.3)
  Top 0.305: v54.4,51.4 54.6,51.2 54.6,48.8 55,48.4 55,42.4 v55.2,42.2 | v65,51.8 65,51.4 64.2,50.6 63.45,50.6 R29.1
  Bottom 0.305: v55.2,42.2 54.6,41.6 50.49,41.6 J3.29 | v54.4,51.4 54.4,51.6 55,52.2 64.6,52.2 v65,51.8
P5.0_SPIMOSI_J2.15
  Top 0.305: J2.15 96.2,49.2 96.8,49.8 96.8,64.8 95.4,66.2 81.4,66.2 81,66.6 81,84.6 81.6,85.2 83.4,85.2 84,85.8 84,87.52 X1.3
P5.1_SPIMISO_J2.14
  Top 0.305: J2.14 96.86,46.66 97.4,47.2 97.4,65.2 95.8,66.8 82.2,66.8 81.6,67.4 81.6,84 82.2,84.6 85,84.6 86.2,85.8 86.2,87.6 X1.5
P5.2_SPICLK_J1.7  (via drill 0.3)
  Top 0.305: v60,35.8 61.6,37.4 61.6,38.8 61,39.4 61,46.6 62,47.6 64.8,47.6 66.2,49 72.6,49 77.4,53.8 77.4,56.8 78.4,57.8 78.4,61.6 78,62 78,63.2 77.4,63.8 77.4,82.6 v77.2,82.8 | J1.7 47.87,46.6 46.2,46.6 45.2,45.6 45.2,36.2 47,34.4 v48,34.4 | X1.7 89,87.6 89,85.8 87,83.8 83,83.8 82.6,83.4 v82.6,82.8
  Bottom 0.305: v60,35.8 59.8,35.6 49.2,35.6 v48,34.4 | v82.6,82.8 v77.2,82.8
P5.3_IO_J2.17
  Top 0.305: J2.17 93.73,54.2 95.8,54.2 96.2,54.6 96.2,64.4 95,65.6 81,65.6 80.4,66.2 80.4,86.88 X1.1
P5.7_PWM_J2.19
  Top 0.305: 93.69,59.4 J2.19
P6.0_UTXD_J1.4
  Top 0.305: J1.4 44.68,54.28 43.4,53 43.4,35 47.6,30.8 64,30.8 65.6,29.2 65.6,22.2 | U$9.P$3 87,5 85,3 79.4,3 76.2,6.2 66.6,6.2 65.74,7 65.74,11.21 U$14.5 arc-90 U$14.5 67,14.8 63.8,18 63.8,21.6 64.4,22.2 65.6,22.2 | 65.6,22.2 65.6,21.6 U$16.4
P6.1_URXD_J1.3  (via drill 0.3)
  Top 0.305: J1.3 44.42,56.82 42.8,55.2 42.8,34.6 47.2,30.2 63.6,30.2 65,28.8 65,23.2 v64.8,23 | U$9.P$4 69.2,7 68.28,7.92 68.28,10.48 69.55,11.75 U$14.3 | 69.6,12.37 U$14.3 | U$14.3 arc90 69.6,12.47 69.6,14.6 65,19.2 65,20.2 65.1,20.3 65.6,20.3 | 65.6,20.3 U$16.6 | v65.6,19.8 65.6,20.3
  Bottom 0.305: v64.8,23 64,22.2 64,21 65.2,19.8 v65.6,19.8
P6.2_IO_J1.5  (via drill 0.3)
  Top 0.305: J1.5 44.94,51.74 44,50.8 44,35.4 48,31.4 64.4,31.4 66.2,29.6 66.2,22.8 v66.4,22.6 | U$14.6 67.01,10.41 68.28,11.68 68.28,14.8 64.4,18.6 64.4,20.6 64.75,20.95 64.8,20.95 | 64.8,20.95 U$16.5 | v64.8,21.4 64.8,20.95
  Bottom 0.305: v66.4,22.6 65.2,21.4 v64.8,21.4
P6.3_IO_J1.8  (via drill 0.3)
  Top 0.305: J1.8 46.52,44.12 45.8,43.4 45.8,36.6 47.2,35.2 48.4,35.2 51.6,32 68.2,32 69.4,30.8 69.4,22.6 v69.2,22.4 | U$14.4 70.83,11.13 70.83,15.6 69.4,17 69.4,20.3 | U$16.1 69.4,20.3 | 69.4,20.3 69.2,20.5 v69.2,20.8
  Bottom 0.305: v69.2,20.8 v69.2,22.4
P7.0_I2CSDA_J1.10  (via drill 0.3)
  Top 0.305: 77,61.4 77.2,61.4 77.6,61 77.6,58.2 76.6,57.2 76.6,54.2 75.09,52.7 U$1.5 73.4,52.2 71,49.8 66,49.8 64.6,48.4 61.8,48.4 60.4,47 60.4,38.8 v60.6,38.6 | 77,61.4 R13.2 | v48.8,37.2 47.93,38.07 J1.10 | X2.3 66.13,87.07 66.8,86.4 68.8,86.4 76.6,78.6 76.6,63.2 77,62.8 77,61.4
  Top 0.813: X2.3 X2.4
  Bottom 0.305: v60.6,38.6 60.6,38.2 60.2,37.8 59.2,37.8 59,37.6 59,37.2 58.6,36.8 49.2,36.8 v48.8,37.2
P7.1_I2CSCL_J1.9  (via drill 0.3)
  Top 0.305: v59.8,37 59.8,47.4 61.6,49.2 64.4,49.2 64.8,49.6 64.8,50 65.4,50.6 69.8,50.6 71.2,52 71.2,53 72.17,53.97 72.83,53.97 | v76.4,58.4 75.85,58.95 R12.2 75.8,59.15 75.8,54.6 75.17,53.97 U$1.6 72.83,53.97 | 72.8,54 72.83,53.97 | J1.9 47.91,41.6 47,41.6 46.4,41 46.4,37.8 v48,36.2 | X2.1 63.59,87.41 65.2,85.8 68.4,85.8 75.8,78.4 v75.8,62.8
  Top 0.813: X2.1 X2.2
  Bottom 0.305: v59.8,37 59,36.2 v48,36.2 | v76.4,58.4 76.4,60 75.8,60.6 v75.8,62.8
P8.1_IO_J2.11
  Top 0.406: R36.2 81.4,21 83.8,23.4 91.2,23.4 93.6,25.8 93.6,38.99 J2.11
PUSH
  Top 0.305: S1.1 S1.2 12.15,3.85 16,3.85 D2.A 17.8,5.25 17.8,6.8 18.2,7.2 18.75,7.2 R22.1

### Text on the board
Top: 1
Bottom: 2
bDocu: P3.7 | P1.2 | P3.6 | P5.7 | P6.1 | P3.5 | P3.0 | P4.4 | P6.0 | P3.4 | P3.1 | P5.3 | P6.2 | P7.3 | P3.2 | !RST | P1.3 | P2.6 | P3.3 | P5.0 | P5.2 | P2.5 | P1.4 | P5.1 | P6.3 | P4.3 | P1.5 | P8.3 | P7.1 | P4.2 | P4.7 | P8.2 | P7.0 | P4.1 | P8.0 | P8.1
bmine: PMOD - I2C | PMOD - SPI | 1 7.1 SCL / 2 7.1 SCL / 3 7.0 SDA / 4 7.0 SDA / 5 GND / 6 GND / 7 3v3 / 8 3v3 | 1 5.3 CS / 2 3.7 gpio / 3 5.0 MOSI / 4 3.6 gpio / 5 5.1 MISO / 6 3.5 gpio / 7 5.2 SCLK / 8 3.4 gpio / 9 GND / 10 GND / 11 3v3 / 12 3v3 | Petre Rodan 202002 devboard rev 1 | J2 | J1 jumper | J1 | v1 module: / J1 open, J2 closed / v2 module: / J1 closed, J2 open | E module | 2 3.3 gpio / 3 6.1 RXD / 4 6.3 gpio / 5 6.0 TXD / 6 6.2 gpio / 9,11 3v3 / 10,12 5v / 14 gnd / 15,16 gnd